# Altium schematic sheet PowerSupplyDUT-reg.SchDoc
size B
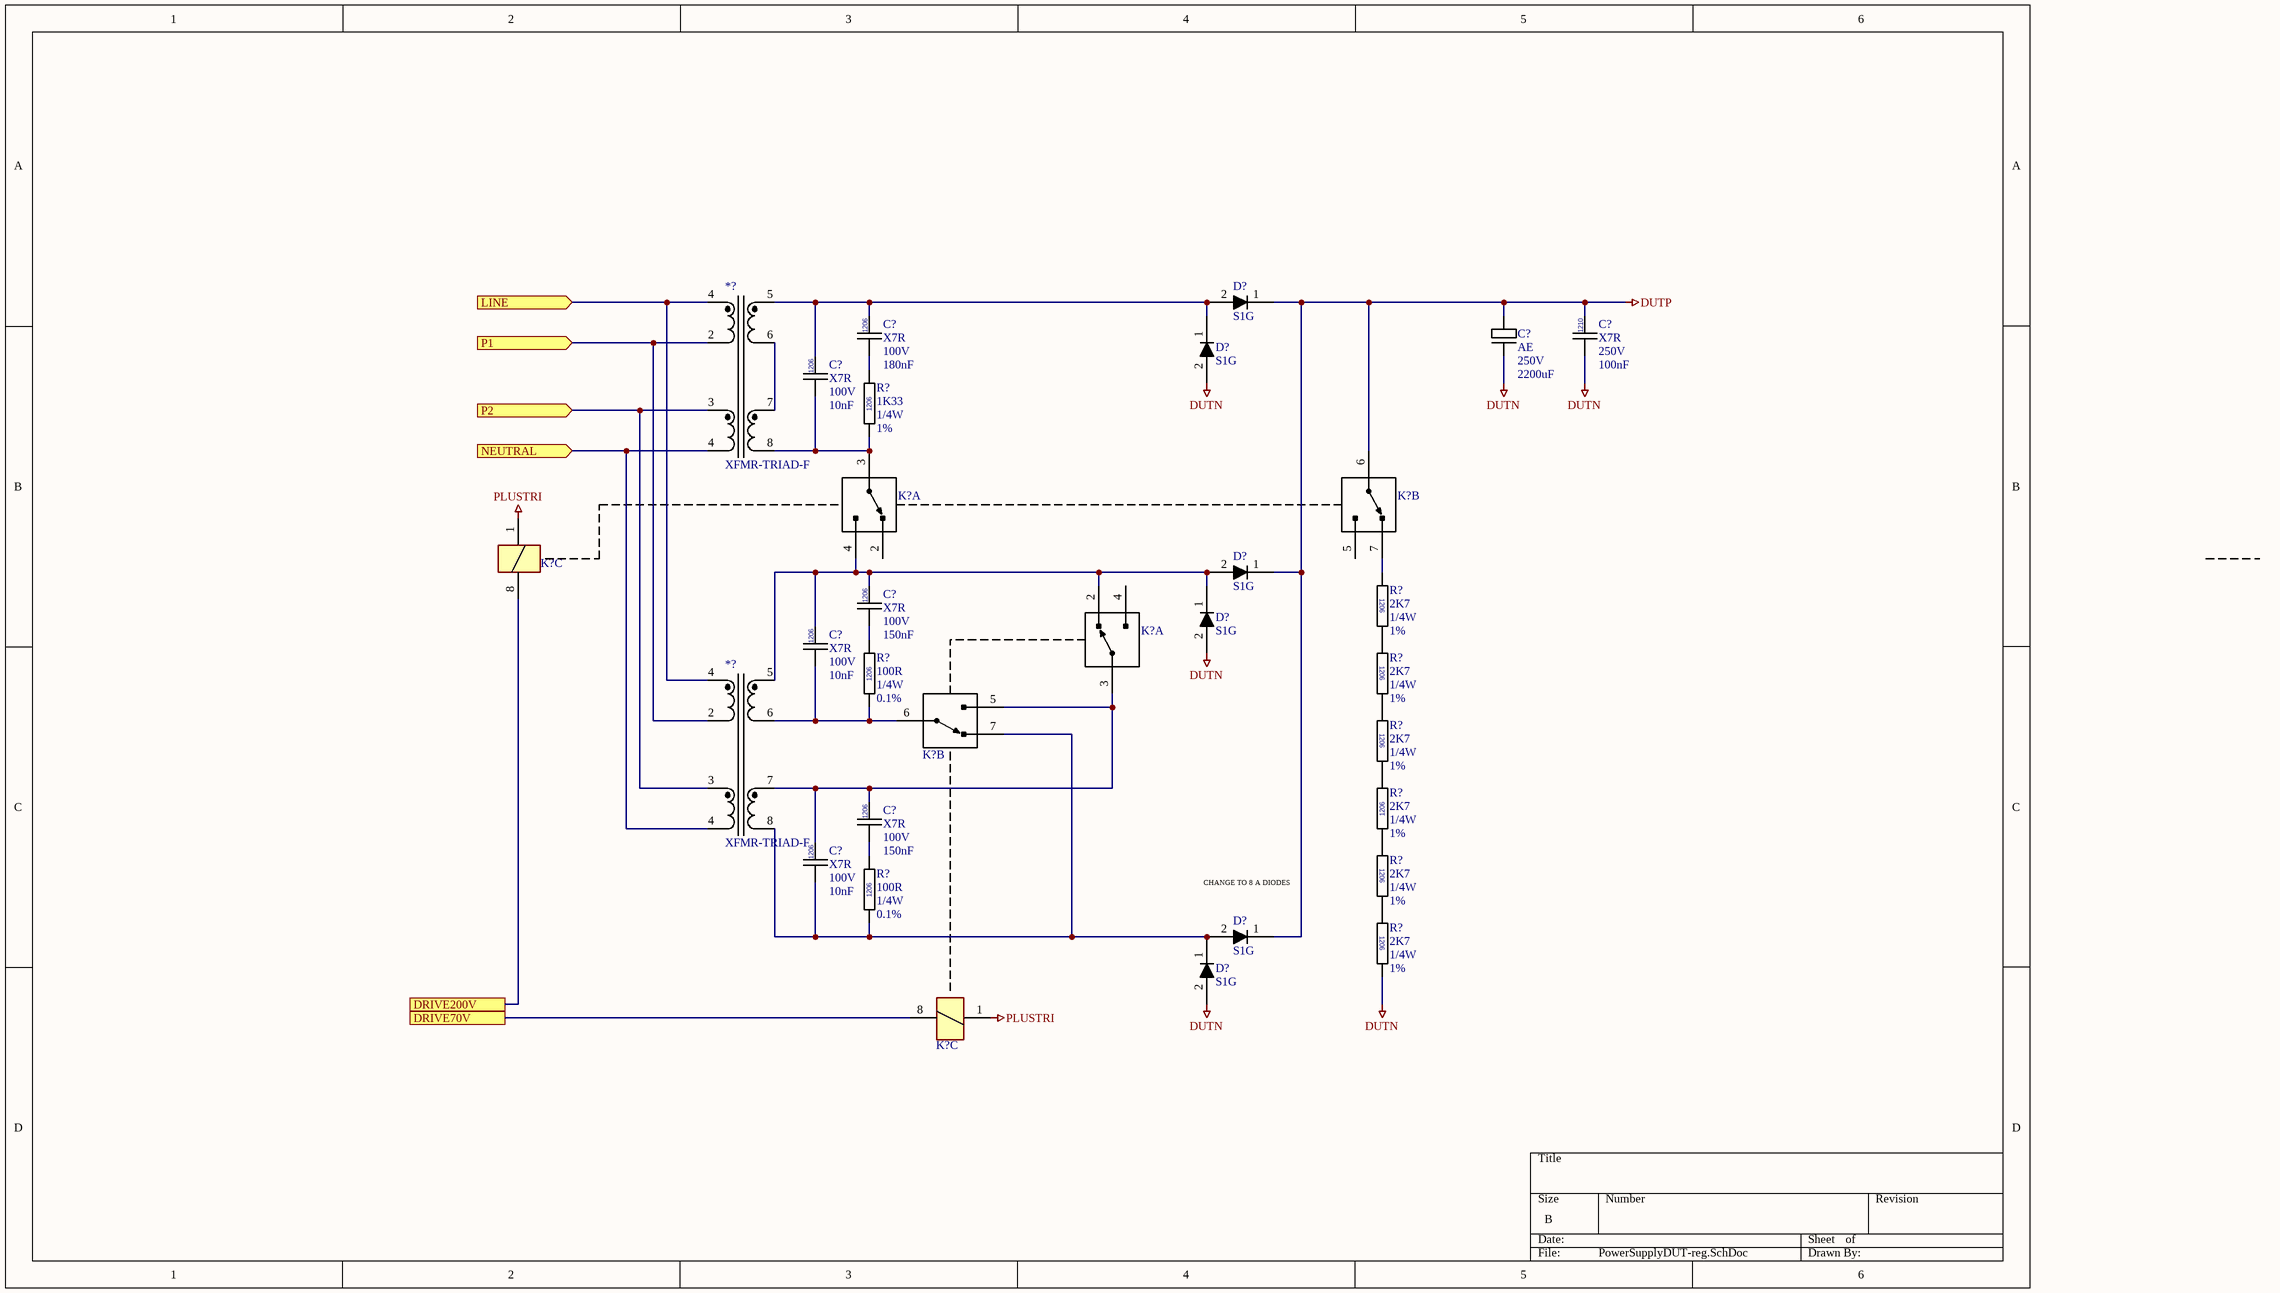
[diagram p0: PowerSupplyDUT-reg.SchDoc]

## Parts
(Parts that share a designator on the sheet are numbered #1, #2 ... from top to bottom, then left to right.)
*?#1  XFMR-TRIAD-F
*?#2  XFMR-TRIAD-F
C?#1  Dielectric: X7R  Voltage: 100V  Capacitance: 180nF  [CAPC0805]  (hidden comment: CAP01206)
C?#2  Dielectric: AE  Voltage: 250V  Capacitance: 2200uF  [CAPC0603]  (hidden comment: CAP0603)
C?#3  Dielectric: X7R  Voltage: 250V  Capacitance: 100nF  [CAPC1210]  (hidden comment: CAPC-1210-100nF-250V-X7R)
C?#4  Dielectric: X7R  Voltage: 100V  Capacitance: 10nF  [CAPC0805]  (hidden comment: CAP01206)
C?#5  Dielectric: X7R  Voltage: 100V  Capacitance: 150nF  [CAPC0805]  (hidden comment: CAP01206)
C?#6  Dielectric: X7R  Voltage: 100V  Capacitance: 10nF  [CAPC0805]  (hidden comment: CAP01206)
C?#7  Dielectric: X7R  Voltage: 100V  Capacitance: 150nF  [CAPC0805]  (hidden comment: CAP01206)
C?#8  Dielectric: X7R  Voltage: 100V  Capacitance: 10nF  [CAPC0805]  (hidden comment: CAP01206)
D?#1  S1G
D?#2  S1G
D?#3  S1G
D?#4  S1G
D?#5  S1G
D?#6  S1G
K?#1  RELA-OMRON-OMRON G6K-2F-Y-TR DC5  (value not drawn)  (part A of 3)
K?#2  RELA-OMRON-OMRON G6K-2F-Y-TR DC5  (value not drawn)  (part B of 3)
K?#3  RELA-OMRON-OMRON G6K-2F-Y-TR DC5  (value not drawn)  (part C of 3)
K?#4  RELA-OMRON-OMRON G6K-2F-Y-TR DC5  (value not drawn)  (part A of 3)
K?#5  RELA-OMRON-OMRON G6K-2F-Y-TR DC5  (value not drawn)  (part B of 3)
K?#6  RELA-OMRON-OMRON G6K-2F-Y-TR DC5  (value not drawn)  (part C of 3)
R?#1  value 1K33  Power: 1/4W  Tolerance: 1%  [RESC1206]  (hidden comment: RESC1206)
R?#2  value 100R  Power: 1/4W  Tolerance: 0.1%  [RESC1206]  (hidden comment: RESC1206)
R?#3  value 2K7  Power: 1/4W  Tolerance: 1%  [RESC1206]  (hidden comment: RESC1206)
R?#4  value 2K7  Power: 1/4W  Tolerance: 1%  [RESC1206]  (hidden comment: RESC1206)
R?#5  value 2K7  Power: 1/4W  Tolerance: 1%  [RESC1206]  (hidden comment: RESC1206)
R?#6  value 2K7  Power: 1/4W  Tolerance: 1%  [RESC1206]  (hidden comment: RESC1206)
R?#7  value 100R  Power: 1/4W  Tolerance: 0.1%  [RESC1206]  (hidden comment: RESC1206)
R?#8  value 2K7  Power: 1/4W  Tolerance: 1%  [RESC1206]  (hidden comment: RESC1206)
R?#9  value 2K7  Power: 1/4W  Tolerance: 1%  [RESC1206]  (hidden comment: RESC1206)

## Ports
DRIVE70V, DRIVE200V, LINE (in), NEUTRAL (in), P1 (in), P2 (in)

## Nets
DUTN: C?#2.2 C?#3.2 D?#2.2(A) D?#4.2(A) D?#5.2(A) R?#9.1
DUTP: C?#2.1 C?#3.1 D?#1.1(K) D?#3.1(K) D?#6.1(K) K?#2.6(COM)
PLUSTRI: K?#3.1 K?#6.1
DRIVE70V: K?#6.8 ; port DRIVE70V
DRIVE200V: K?#3.8 ; port DRIVE200V
LINE: *?#1.4 *?#2.4 ; port LINE
NEUTRAL: *?#1.4 *?#2.4 ; port NEUTRAL
P1: *?#1.2 *?#2.2 ; port P1
P2: *?#1.3 *?#2.3 ; port P2
Net*?#1_5: *?#1.5 C?#1.1 C?#4.1 D?#1.2(A) D?#2.1(K)
Net*?#1_6: *?#1.6 *?#1.7
Net*?#1_8: *?#1.8 C?#4.2 K?#1.3(COM) R?#1.2
Net*?#2_5: *?#2.5 C?#5.1 C?#6.1 D?#3.2(A) D?#4.1(K) K?#1.4(NO) K?#4.2(NC)
Net*?#2_6: *?#2.6 C?#6.2 K?#5.6(COM) R?#2.2
Net*?#2_7: *?#2.7 C?#7.1 C?#8.1 K?#4.3(COM) K?#5.5(NO)
Net*?#2_8: *?#2.8 C?#8.2 D?#5.1(K) D?#6.2(A) K?#5.7(NC) R?#7.2
NetC?#1_2: C?#1.2 R?#1.1
NetC?#5_2: C?#5.2 R?#2.1
NetC?#7_2: C?#7.2 R?#7.1
NetK?#2_7: K?#2.7(NC) R?#3.2
NetR?#3_1: R?#3.1 R?#4.2
NetR?#4_1: R?#4.1 R?#6.2
NetR?#5_1: R?#5.1 R?#6.1
NetR?#5_2: R?#5.2 R?#8.2
NetR?#8_1: R?#8.1 R?#9.2

Not connected (* = marked no-connect by the designer): K?#1 2(NC); K?#2 5(NO); K?#4 4(NO)

## Notes on the sheet
- (near D?#6) CHANGE TO 8 A DIODES
- (in symbol CAPC-1206-10nF-250V-X7R) 1206
- (in symbol CAPC-1206-100nF-250V-X7R) 1206
- (in symbol CAPC-1206-150nF-250V-X7R) 1206
- (in symbol CAPC-1210-100nF-250V-X7R_1) 1210
- (in symbol RESC-1206-1K33-1%-1/4W) 1206
- (in symbol RESC-1206-2K7-1%-1/4W) 1206
- (in symbol RESC-1206-100R-0.1%-1/4W) 1206

## Library data of the parts
C?#1 = CAPC-1206-100nF-250V-X7R: CAPACITOR,CERAMIC,100nF,250V,X7R,1206; Package / Case: 0805 (2012 metric); Location: *
C?#2 = CAPP-AE-2200uF-250V: CAPACITOR,ALU,2200uF,250V,63X77; Location: *
C?#3 = CAPC-1210-100nF-250V-X7R_1: CAPACITOR,CERAMIC,100nF,250V,X7R,1210; Manufacturer 1: WALSIN; Manufacturer Part Number 1: SH43B474K251CT; Package / Case: 1210 (3225 METRIC); Location: *; Supplier 1: Mouser; Supplier Part Number 1: 80-C1210C474KARACTU; Supplier 2: Digikey; Supplier Part Number 2: 4587-C1210X474K251TCT-ND; Supplier 3: Digikey; Supplier Part Number 3: 4713-CHV1210N250474KXTCT-ND; Supplier 4: Mouser; Supplier Part Number 4: 80-C1210C474KARAUTO; Supplier 5: Mouser; Supplier Part Number 5: 80-C1210X474KARAUTO; MOUSER: 791-SH43B474K251CT
C?#4 C?#6 C?#8 = CAPC-1206-10nF-250V-X7R: CAPACITOR,CERAMIC,10nF,250V,X7R,1206; Package / Case: 0805 (2012 metric); Location: *
C?#5 C?#7 = CAPC-1206-150nF-250V-X7R: CAPACITOR,CERAMIC,150nF,250V,X7R,1206; Package / Case: 0805 (2012 metric); Location: *
D?#1-D?#6 = DIODE-SMC-S1G: Manufacturer 1: SMC DIODE SOLUTIONS; Manufacturer Part Number 1: S1G
R?#1 = RESC-1206-1K33-1%-1/4W: RESISTOR,1K33,1206,1%,125mW,0805; Location: *; Parameter 4: *
R?#2 R?#7 = RESC-1206-100R-0.1%-1/4W: RESISTOR,100R,1206,0.1%,125mW,0805; Location: *; Parameter 4: *
R?#3-R?#6 R?#8 R?#9 = RESC-1206-2K7-1%-1/4W: RESISTOR,2K7,1206,1%,125mW,0805; Location: *; Parameter 4: *